# Altium schematic sheet NFC_Access_Pwr_R00.SchDoc: NFC Access Board
size A4; Author: Hernan M. Travado; CompanyName: UTN FRBA; Revision: 1.0; SheetNumber: 2; SheetTotal: 7
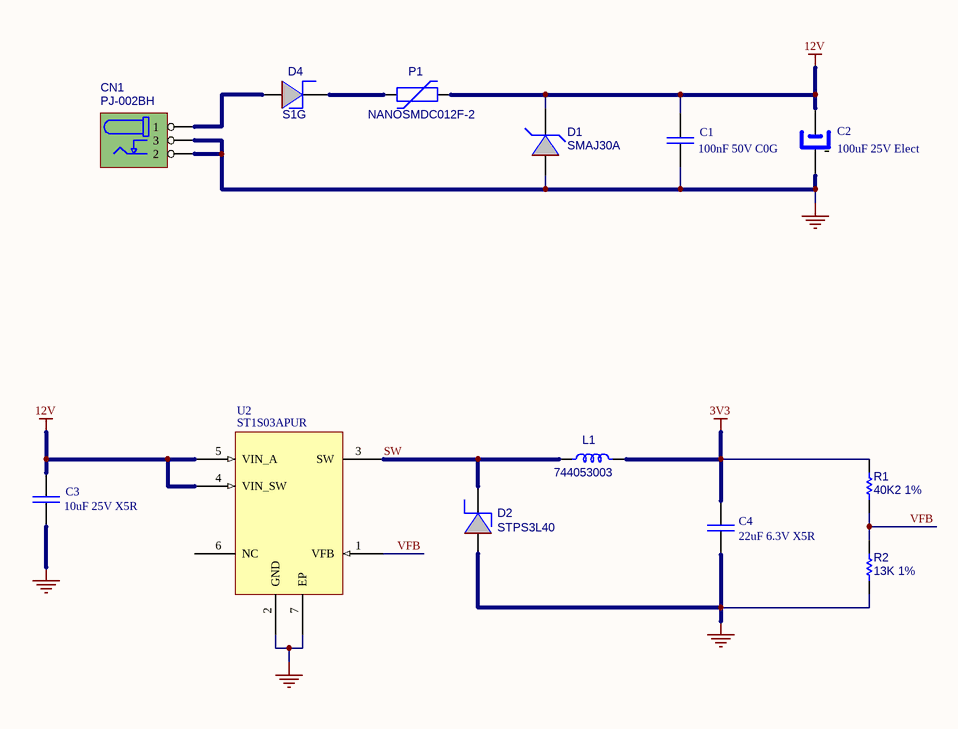
[diagram p0: NFC_Access_Pwr_R00.SchDoc]

## Parts
C1  100nF 50V C0G  [C_1206]
C2  100uF 25V Elect  [CAP_ELECT_6.3_7.7]
C3  10uF 25V X5R  [C_1206]
C4  22uF 6.3V X5R  [C_1206]
CN1  PJ-002BH  [PJ002B]
D1  SMAJ30A  [D_SMA]
D2  STPS3L40  [D_214]
D4  S1G  [D_SMA]
L1  744053003  [744053003]
P1  NANOSMDC012F-2  [NANOSMDC]
R1  40K2 1%  [R_0603]
R2  13K 1%  [R_0603]
U2  ST1S03APUR  [6-VDFN]

## Nets
3V3: C4.1 L1.2 R1.2
12V: C1.1 C2.1 C3.1 D1.2(K) P1.2 U2.4(VIN_SW) U2.5(VIN_A)
GND: C1.2 C2.2 C3.2 C4.2 CN1.2 CN1.3 D1.1(A) D2.1(A) R2.1 U2.2(GND) U2.7(EP)
SW: D2.2(K) L1.1 U2.3(SW)
VFB: R1.1 R2.2 U2.1(VFB)
NetCN1_1: CN1.1 D4.1(A)
NetD4_2: D4.2(K) P1.1

Not connected (* = marked no-connect by the designer): U2 6(NC)

## Notes on the sheet
- Title:
- Size:
- Author:
- A4
- Sheet
- of
- Revision:
- File:
- Date:

## Library data of the parts
C1 = Ceramic capacitor: Ceramic Capacitor / MNF: GRM31C5C1H104JA01L / DGK: 490-6505-2-ND
C2 = Pol capacitor: Polarized Capacitor / 732-8438-2-ND
C3 = Ceramic capacitor: Ceramic Capacitor / MNF:GRM31CR61E106KA12L / DGK:490-3373-2-ND
C4 = Ceramic capacitor: Ceramic Capacitor / MNF: GRM31CR60J226KE19L / DGK: 490-1824-2-ND
CN1 = CN_PowerJack: Barrel Power Connector / CP-002BH-ND
D1 = DIODE_TVS: Unidirectional TVS / SMAJ30ABTR-ND
D2 = DIODO_SH: Diode Shottky / 497-4673-2-ND
D4 = DIODO_SH: Diode Shottky / 1655-S1GTR-ND
L1 = IND: FIXED IND 3UH 2.8A 30 MOHM SMD / 732-1037-2-ND
P1 = PLYSW: Polyswitch / NANOSMDC012F-2TR-ND
R1 = Res1: Resistor / CR0603-FX-4022ELFTR-ND
R2 = Res1: Resistor / CR0603-FX-1302ELFTR-ND
U2 = ST1S03: IC REG BUCK ADJUSTABLE 1.5A / 497-6902-2-ND